# Altium schematic sheet PAGE01 BLOCK DIAGRAM.SchDoc
size 420 x 297 mm; SheetNumber: 1; SheetTotal: 9
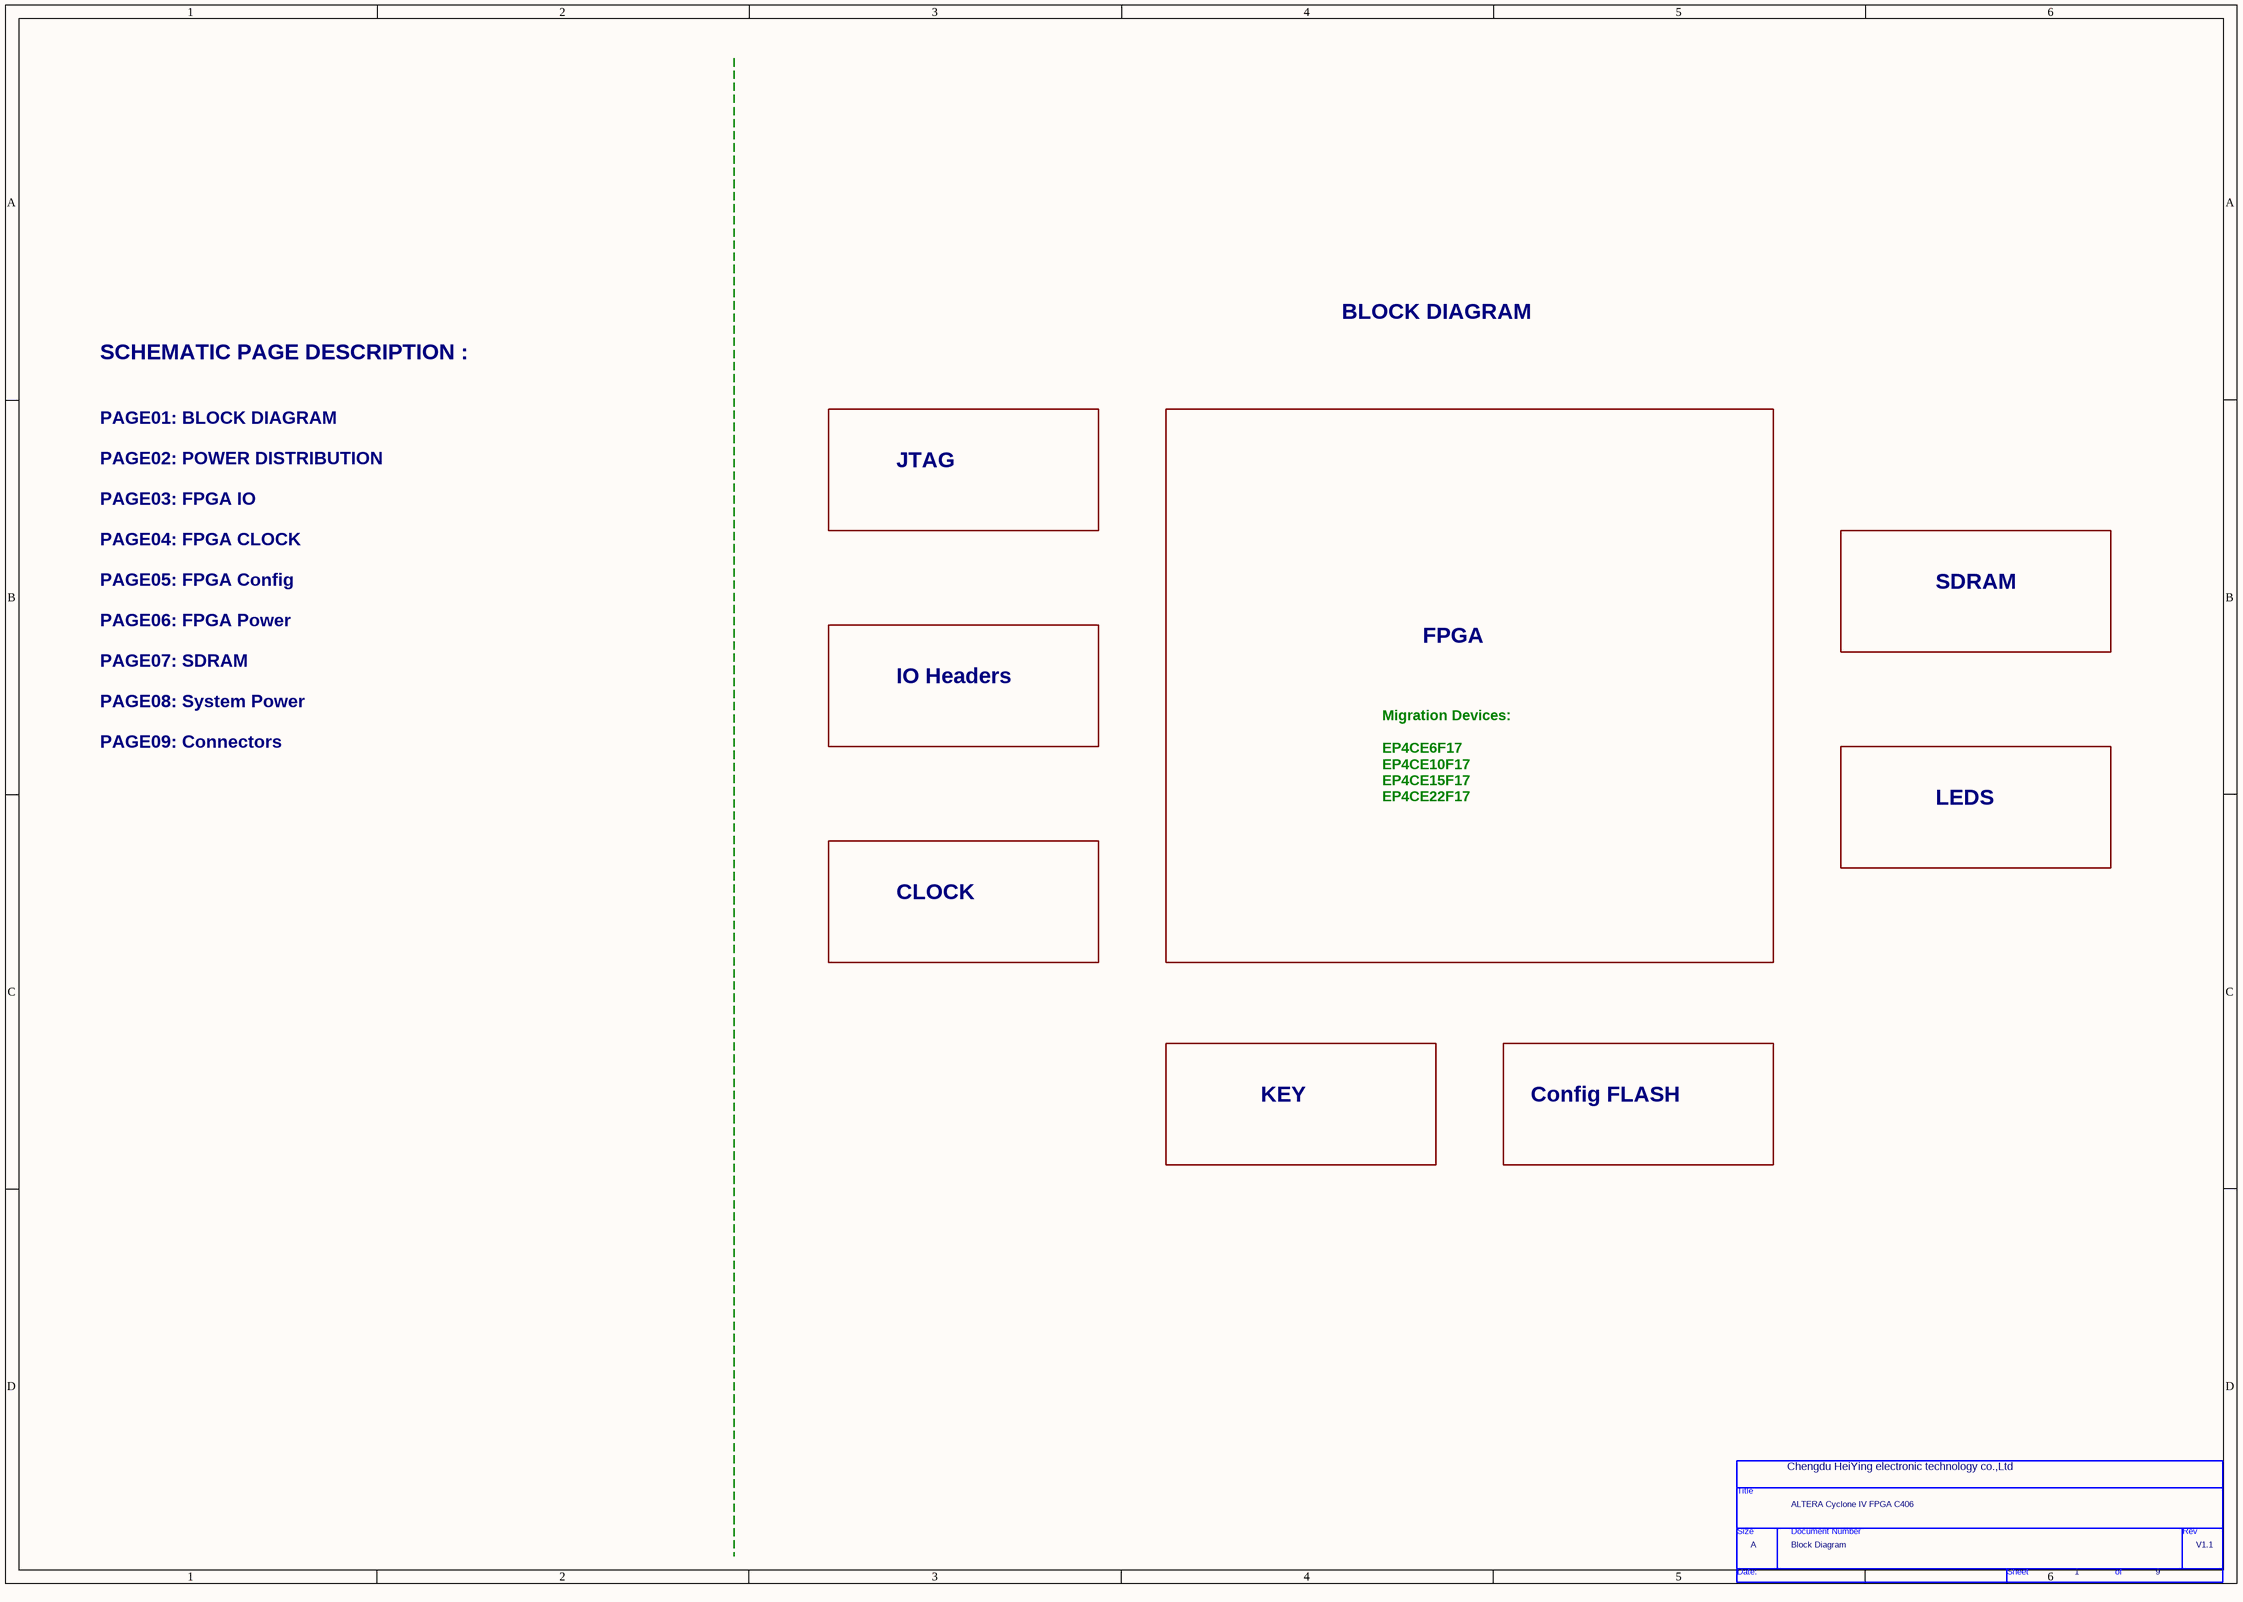
[diagram p0: PAGE01 BLOCK DIAGRAM.SchDoc]

## Parts
*  Page Count: 9  Page Number: 1  Page Size: A  Title: ALTERA Cyclone IV FPGA C406  RevCode: V1.1  Doc: Block Diagram  (hidden comment: TitleBlock0)  (graphical)

## Notes on the sheet
- BLOCK DIAGRAM
- SCHEMATIC PAGE DESCRIPTION :
- PAGE01: BLOCK DIAGRAM
- PAGE02: POWER DISTRIBUTION
- PAGE03: FPGA IO
- JTAG
- PAGE04: FPGA CLOCK
- PAGE05: FPGA Config
- SDRAM
- PAGE06: FPGA Power
- PAGE07: SDRAM
- FPGA
- PAGE08: System Power
- IO Headers
- PAGE09: Connectors
- Migration Devices:
  EP4CE6F17
  EP4CE10F17
  EP4CE15F17
  EP4CE22F17
- LEDS
- CLOCK
- KEY
- Config FLASH
- (near *) Chengdu HeiYing electronic technology co.,Ltd
- (in symbol TitleBlock0) Title; Size; Document Number; Rev; Date:; Sheet; of

## Library data of the parts
* = TitleBlock0: Page Create Date: March  8, 1995